# EAGLE design S8254A-HY2213-4S (EAGLE 7.6.0)

## Sheet 1 of 2
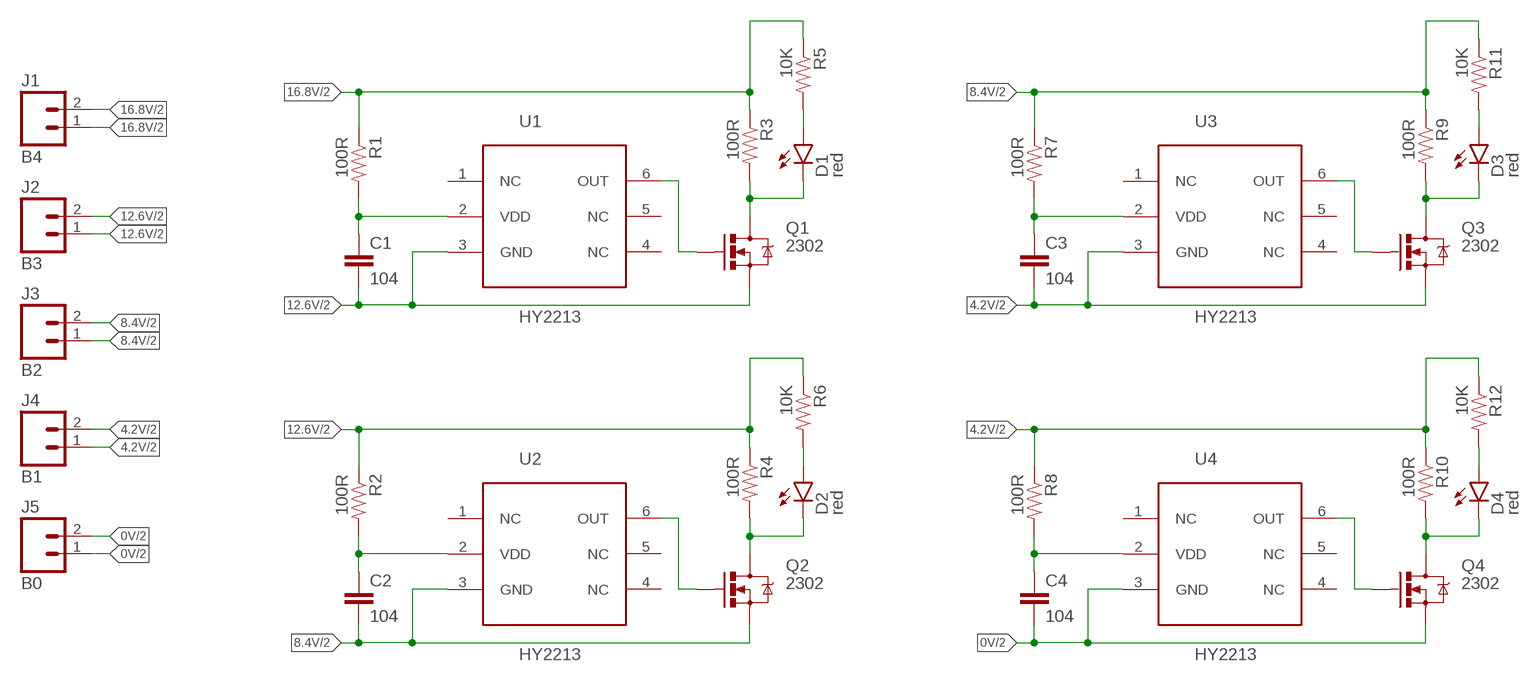
[diagram p0: schematic, sheet 1]

### Parts
C1  104  CAP0603-CAP  [0603-CAP]
C2  104  CAP0603-CAP  [0603-CAP]
C3  104  CAP0603-CAP  [0603-CAP]
C4  104  CAP0603-CAP  [0603-CAP]
D1  red  LED-SEEED-0603  [LED-0603-SEEED]
D2  red  LED-SEEED-0603  [LED-0603-SEEED]
D3  red  LED-SEEED-0603  [LED-0603-SEEED]
D4  red  LED-SEEED-0603  [LED-0603-SEEED]
J1  B4  M021X02_NO_SILK  [1X02_NO_SILK]
J2  B3  M021X02_NO_SILK  [1X02_NO_SILK]
J3  B2  M021X02_NO_SILK  [1X02_NO_SILK]
J4  B1  M021X02_NO_SILK  [1X02_NO_SILK]
J5  B0  M021X02_NO_SILK  [1X02_NO_SILK]
Q1  2302  MOSFET-NCHANNELAO3404A  [SOT23-3]
Q2  2302  MOSFET-NCHANNELAO3404A  [SOT23-3]
Q3  2302  MOSFET-NCHANNELAO3404A  [SOT23-3]
Q4  2302  MOSFET-NCHANNELAO3404A  [SOT23-3]
R1  100R  RESISTOR0603  [0603-RES]
R2  100R  RESISTOR0603  [0603-RES]
R3  100R  RESISTOR2512  [R2512]
R4  100R  RESISTOR2512  [R2512]
R5  10K  RESISTOR0603  [0603-RES]
R6  10K  RESISTOR0603  [0603-RES]
R7  100R  RESISTOR0603  [0603-RES]
R8  100R  RESISTOR0603  [0603-RES]
R9  100R  RESISTOR2512  [R2512]
R10  100R  RESISTOR2512  [R2512]
R11  10K  RESISTOR0603  [0603-RES]
R12  10K  RESISTOR0603  [0603-RES]
U1  HY2213  [SOT23-6]
U2  HY2213  [SOT23-6]
U3  HY2213  [SOT23-6]
U4  HY2213  [SOT23-6]

### Nets
0V: C4.2 J5.1 J5.2 Q4.2(S) U4.3(GND) ; also sheet 2
4.2V: C3.2 J4.1 J4.2 Q3.2(S) R8.1 R10.1 R12.1 U3.3(GND) ; also sheet 2
8.4V: C2.2 J3.1 J3.2 Q2.2(S) R7.1 R9.1 R11.1 U2.3(GND) ; also sheet 2
12.6V: C1.2 J2.1 J2.2 Q1.2(S) R2.1 R4.1 R6.1 U1.3(GND) ; also sheet 2
16.8V: J1.1 J1.2 R1.1 R3.1 R5.1 ; also sheet 2
N$1: C1.1 R1.2 U1.2(VDD)
N$3: Q1.1(G) U1.6(OUT)
N$4: D1.-(C) Q1.3(D) R3.2
N$6: C2.1 R2.2 U2.2(VDD)
N$7: Q2.1(G) U2.6(OUT)
N$8: D2.-(C) Q2.3(D) R4.2
N$9: C3.1 R7.2 U3.2(VDD)
N$10: Q3.1(G) U3.6(OUT)
N$11: D3.-(C) Q3.3(D) R9.2
N$12: C4.1 R8.2 U4.2(VDD)
N$13: Q4.1(G) U4.6(OUT)
N$14: D4.-(C) Q4.3(D) R10.2
N$25: D1.+(A) R5.2
N$27: D2.+(A) R6.2
N$29: D3.+(A) R11.2
N$31: D4.+(A) R12.2
Unconnected: U1.1(NC) U1.4(NC) U1.5(NC) U2.1(NC) U2.4(NC) U2.5(NC) U3.1(NC) U3.4(NC) U3.5(NC) U4.1(NC) U4.4(NC) U4.5(NC)

## Sheet 2 of 2
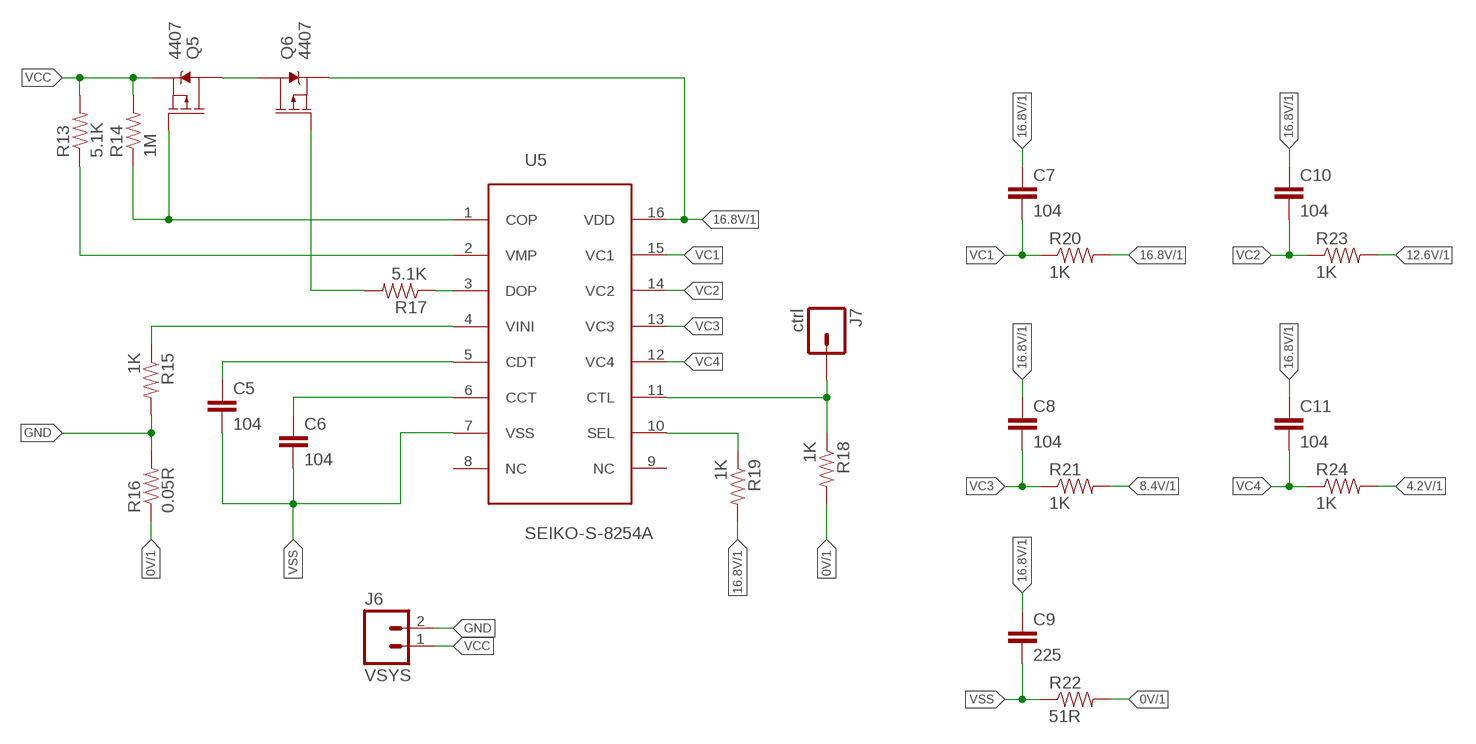
[diagram p1: schematic, sheet 2]

### Parts
C5  104  CAP0603-CAP  [0603-CAP]
C6  104  CAP0603-CAP  [0603-CAP]
C7  104  CAP0603-CAP  [0603-CAP]
C8  104  CAP0603-CAP  [0603-CAP]
C9  225  CAP0603-CAP  [0603-CAP]
C10  104  CAP0603-CAP  [0603-CAP]
C11  104  CAP0603-CAP  [0603-CAP]
J6  VSYS  M021X02_NO_SILK  [1X02_NO_SILK]
J7  ctrl  M01PTH  [1X01]
Q5  4407  MOSFET_PCH-NDS8434  [SO08]
Q6  4407  MOSFET_PCH-NDS8434  [SO08]
R13  5.1K  RESISTOR0603  [0603-RES]
R14  1M  RESISTOR0603  [0603-RES]
R15  1K  RESISTOR0603  [0603-RES]
R16  0.05R  RESISTOR2512  [R2512]
R17  5.1K  RESISTOR0603  [0603-RES]
R18  1K  RESISTOR0603  [0603-RES]
R19  1K  RESISTOR0603  [0603-RES]
R20  1K  RESISTOR0603  [0603-RES]
R21  1K  RESISTOR0603  [0603-RES]
R22  51R  RESISTOR0603  [0603-RES]
R23  1K  RESISTOR0603  [0603-RES]
R24  1K  RESISTOR0603  [0603-RES]
U5  SEIKO-S-8254A  [TSSOP16]

### Nets
0V: R16.1 R18.2 R22.2 ; also sheet 1
4.2V: R24.2 ; also sheet 1
8.4V: R21.2 ; also sheet 1
12.6V: R23.2 ; also sheet 1
16.8V: C7.1 C8.1 C9.1 C10.1 C11.1 Q6.1(S) Q6.2(S) Q6.3(S) R19.2 R20.2 U5.16(VDD) ; also sheet 1
GND: J6.2 R15.2 R16.2
N$2: R19.1 U5.10(SEL)
N$5: J7.1 R18.1 U5.11(CTL)
N$16: Q5.4(G) R14.1 U5.1(COP)
N$17: R17.1 U5.3(DOP)
N$18: Q6.4(G) R17.2
N$19: R13.1 U5.2(VMP)
N$20: R15.1 U5.4(VINI)
N$21: C5.1 U5.5(CDT)
N$22: C6.1 U5.6(CCT)
QQ: Q5.5(D) Q5.6(D) Q5.7(D) Q5.8(D) Q6.5(D) Q6.6(D) Q6.7(D) Q6.8(D)
VC1: C7.2 R20.1 U5.15(VC1)
VC2: C10.2 R23.1 U5.14(VC2)
VC3: C8.2 R21.1 U5.13(VC3)
VC4: C11.2 R24.1 U5.12(VC4)
VCC: J6.1 Q5.1(S) Q5.2(S) Q5.3(S) R13.2 R14.2
VSS: C5.2 C6.2 C9.2 R22.1 U5.7(VSS)
Unconnected: U5.8(NC) U5.9(NC)

## Library data of the parts
C1-C11 = z_jlc_smt:CAP: Capacitor Standard 0603 ceramic capacitor, and 0.1" leaded capacitor.
D1-D4 = z_jlc_smt:LED: LEDs Standard schematic elements and footprints for 5mm, 3mm, 1206, and 0603 sized LEDs. 5mm - Spark Fun Electronics SKU : COM-00529 (and others)
J1-J6 = SparkFun-Connectors:M02: Standard 2-pin 0.1" header. Use with - straight break away headers ( PRT-00116) - right angle break away headers (PRT-00553) - swiss pins (PRT-00743) - machine pins (PRT-00117) - female headers (PRT-00115) Molex polarized connector foot print use with: PRT-08233 with associated crimp pins and housings. 2.54_SCREWTERM for use with PRT-10571. 3.5mm Screw Terminal footprints for PRT-08084 5mm Screw Terminal footprints for use with PRT-08432
J7 = SparkFun-Connectors:M01: Header 1 Standard 1-pin 0.1" header. Use with straight break away headers (SKU : PRT-00116), right angle break away headers (PRT-00553), swiss pins (PRT-00743), machine pins (PRT-00117), and female headers (PRT-00115). SMTSO-256-ET is a "flush mount" nut for a 4-40 screw. The older package used to be too tight, and did not allow it to sit properly thru the drill hit. The latest (0.165DIA) fits nice and snug.
Q1-Q4 = xmgu2008:MOSFET-NCHANNEL: Common NMOSFET Parts MFG P/N Store ID Prod ID FDD8780 TRANS-09984 SI7820DN TRANS-11055 FDS6630A IC-08089 2N7002PW TRANS-11151 FQP30N06L COM-10213 TRANS-10060 BSS123LT1G TRANS-08345 BSS138 TRANS-00830 BS170 2N7000; PROD_ID: TRAN-12988
Q5 Q6 = SparkFun-DiscreteSemi:MOSFET_PCH: P-channel MOSFETs Voltage controlled devices that allow control of high current outputs. SparkFun Products: SparkFun ESP32 Thing <https://www.sparkfun.com/products/13907> SparkFun ESP8266 Thing <https://www.sparkfun.com/products/13231>; PROD_ID: TRANS-08355; VALUE: 6.5A/20V/35mΩ
R1-R24 = z_jlc_smt:RESISTOR: Resistor Basic schematic elements and footprints for 0603, 1206, and PTH resistors.
U1-U4 = xmgu2008:HY2213
U5 = xmgu2008:SEIKO-S-8254A

## Board
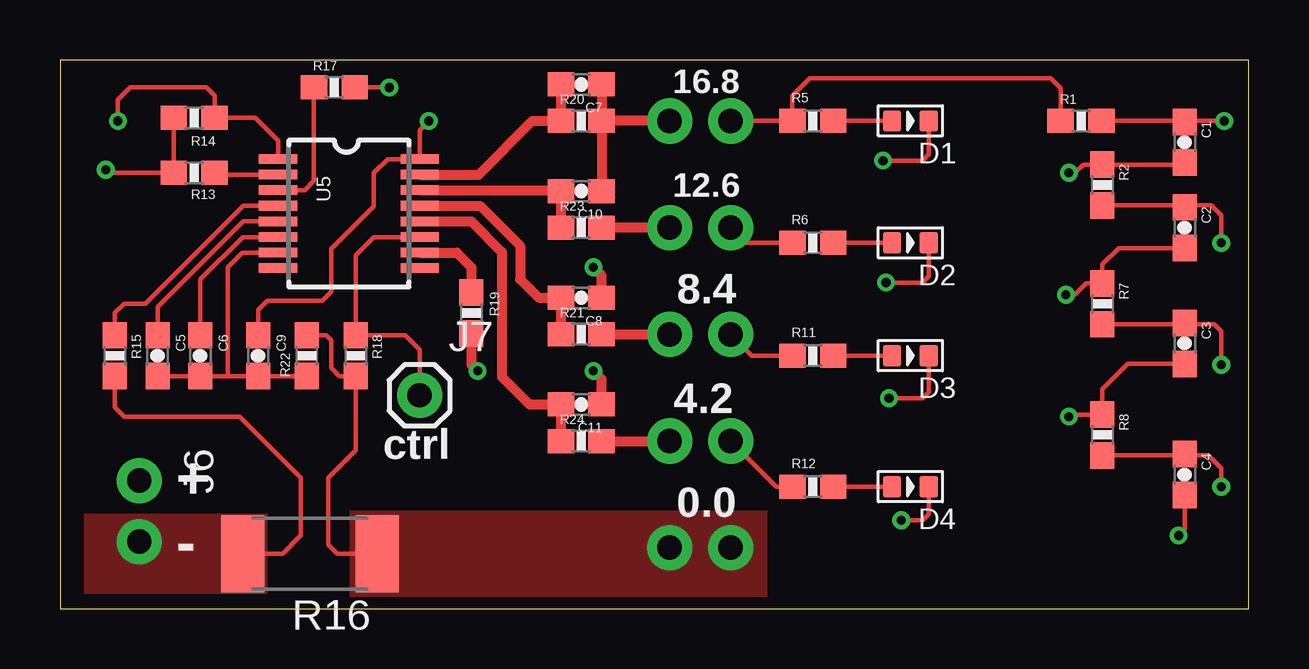
[diagram p2: board, top side]
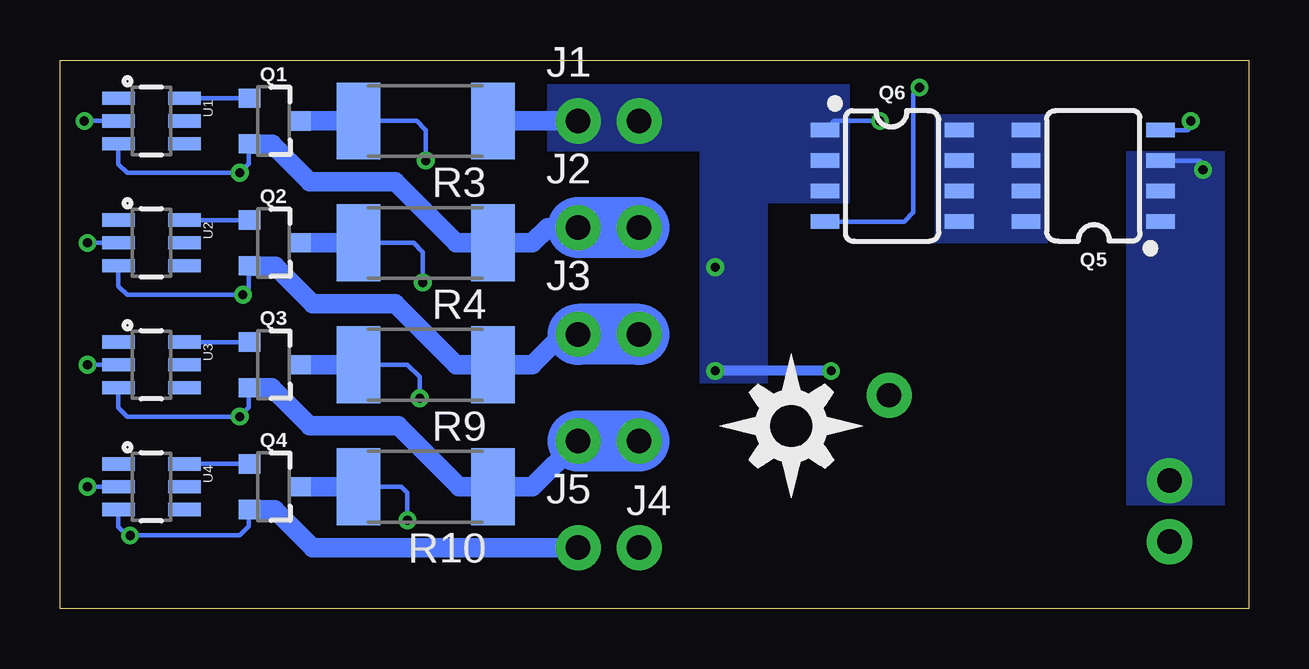
[diagram p3: board, bottom side, seen from below]

Size 49.53 x 22.86 mm. Coordinates in mm from the lower left corner, seen from the top.
Outline: 49.53,0 49.53,22.86 0,22.86 0,0 49.53,0
Copper layers (1*16): Top 0.035mm / dielectric 1.5mm / Bottom 0.035mm
Design rules "SparkFun-2-layer-TIGHT": minimum track width 7mil, minimum drill 15mil, track to track 7mil, track to pad 7mil, pad to pad 7mil, via to via 7mil, smd to smd 7mil, copper to edge 7mil, drill to drill 7mil, minimum pad ring 7mil, minimum via ring 7mil, stop-mask expansion 4mil, vias tented up to drill 20mil, thermal gap 10mil

### Footprints (pad centres in the part's own frame; a part is rotated, then mirrored left to right if it is on the bottom)
0603-CAP = smd 1.1 x 1: 1 -0.85,0; 2 0.85,0
LED-0603-SEEED = smd 0.762 x 0.889: + 0.762,0; - -0.762,0
1X02_NO_SILK = drill 1.016 pad 1.88: 1 0,0; 2 2.54,0
1X01 = drill 1.016 pad 1.88: 1 0,0
SOT23-3 = smd 0.8 x 0.9: 1 -0.95,-1; 2 0.95,-1; 3 0,1.1
SO08 = smd 0.6 x 1.2: 1 -1.905,-2.8; 2 -0.635,-2.8; 3 0.635,-2.8; 4 1.905,-2.8; 5 1.905,2.8; 6 0.635,2.8; 7 -0.635,2.8; 8 -1.905,2.8
0603-RES = smd 1.1 x 1: 1 -0.85,0; 2 0.85,0
R2512 = smd 1.8 x 3.2: 1 -2.8,0; 2 2.8,0
SOT23-6 = smd 0.55 x 1.35: 1 -0.95,-1.375; 2 0,-1.375; 3 0.95,-1.375; 4 0.95,1.375; 5 0,1.375; 6 -0.95,1.375
TSSOP16 = smd 0.4 x 1.6: 1 -2.225,-2.85; 2 -1.575,-2.85; 3 -0.925,-2.85; 4 -0.275,-2.85; 5 0.375,-2.85; 6 1.025,-2.85; 7 1.675,-2.85; 8 2.325,-2.85; 9 2.325,3.05; 10 1.675,3.05; 11 1.025,3.05; 12 0.375,3.05; 13 -0.275,3.05; 14 -0.925,3.05; 15 -1.575,3.05; 16 -2.225,3.05

### Placement (x,y rotation side)
C1  46.86,19.43 270 top
C2  46.86,15.88 270 top
C3  46.86,11.05 270 top
C4  46.86,5.59 270 top
C5  4.06,10.54 270 top
C6  5.84,10.54 270 top
C7  21.72,21.84 180 top
C8  21.72,12.95 180 top
C9  8.26,10.54 270 top
C10  21.72,17.4 180 top
C11  21.72,8.51 180 top
D1  35.43,20.32 180 top
D2  35.43,15.24 180 top
D3  35.43,10.54 180 top
D4  35.43,5.08 180 top
J1  27.94,20.32 0 bottom
J2  27.94,15.88 0 bottom
J3  27.94,11.43 0 bottom
J4  25.4,6.99 180 bottom
J5  27.94,2.54 0 bottom
J6  3.3,5.33 270 top
J7  14.99,8.89 0 top
Q1  40.64,20.32 270 bottom
Q2  40.64,15.24 270 bottom
Q3  40.64,10.16 270 bottom
Q4  40.64,5.08 270 bottom
Q5  6.48,18.03 90 bottom
Q6  14.86,18.03 270 bottom
R1  42.55,20.32 0 top
R2  43.43,17.65 270 top
R3  34.29,20.32 180 bottom
R4  34.29,15.24 180 bottom
R5  31.37,20.32 0 top
R6  31.37,15.24 0 top
R7  43.43,12.7 270 top
R8  43.43,7.24 270 top
R9  34.29,10.16 180 bottom
R10  34.29,5.08 180 bottom
R11  31.37,10.54 0 top
R12  31.37,5.08 0 top
R13  5.59,18.16 180 top
R14  5.59,20.45 180 top
R15  2.29,10.54 270 top
R16  10.41,2.29 180 top
R17  11.43,21.72 0 top
R18  12.32,10.54 270 top
R19  17.14,12.32 270 top
R20  21.72,20.32 0 top
R21  21.72,11.43 0 top
R22  10.29,10.54 90 top
R23  21.72,15.88 0 top
R24  21.72,6.99 0 top
U1  45.72,20.32 270 bottom
U2  45.72,15.24 270 bottom
U3  45.72,10.16 270 bottom
U4  45.72,5.08 270 bottom
U5  11.94,16.51 270 top
U$1  [DIYNOVA_LOGO]  22.1,4.57 0 bottom

### Tracks (layer width: path | path; a pad name or v marks a point on that pad's centre or on a via)
0V  (via drill 0.38)
  Top 0.178: R22.2 11.09,11.39 11.3,11.18 11.3,10.03 11.64,9.69 R18.2 12.32,6.6 11.18,5.46 11.18,2.67 11.56,2.29 R16.1 | C4.2 46.86,3.3 v46.61,3.05
  Bottom 0.178: U4.3 47.09,3.41 46.74,3.05 v46.61,3.05 42.04,3.05 41.66,3.43 41.66,4.11 Q4.2
  Bottom 0.813: Q4.2 40.58,4.13 38.99,2.54 J5.1
  pour Top (isolate 0.305, no thermals): 12.06,4.06 12.06,0.51 29.46,0.51 29.46,4.06
4.2V  (via drill 0.38)
  Top 0.178: R12.1 29.84,5.08 J4.2 | C3.2 44.49,10.2 43.43,9.14 R8.1 42.12,8.09 v42.04,8
  Top 0.406: R24.2 J4.1
  Bottom 0.178: U3.3 47.09,8.36 46.74,8 v42.04,8 41.66,8.38 41.66,9.19 Q3.2
  Bottom 0.813: Q3.2 40.71,9.21 39.12,7.62 35.43,7.62 32.89,5.08 R10.1 29.84,5.08 J4.2
  Bottom 2.54: J4.1 J4.2
8.4V  (via drill 0.38)
  Top 0.178: R11.1 28.83,10.54 J3.1 | v41.91,13.08 42.29,13.08 42.76,13.55 R7.1 43.43,14.35 44.11,15.03 C2.2
  Top 0.406: R21.2 J3.2
  Bottom 0.178: U2.3 47.09,13.44 46.74,13.08 v41.91,13.08 41.66,13.34 41.66,14.27 Q2.2
  Bottom 0.813: 41.66,14.27 40.56,14.27 38.99,12.7 35.56,12.7 33.02,10.16 R9.1 29.84,10.16 28.57,11.43 J3.1
  Bottom 2.54: J3.2 J3.1
12.6V  (via drill 0.38)
  Top 0.178: R6.1 28.57,15.24 J2.1 | v42.04,18.16 42.29,18.16 42.63,18.5 R2.1 46.78,18.5 C1.2
  Top 0.406: J2.2 R23.2
  Bottom 0.178: U1.3 47.09,18.52 46.74,18.16 v42.04,18.16 41.66,18.54 41.66,19.35 Q1.2
  Bottom 0.813: 41.66,19.35 40.69,19.35 39.12,17.78 35.56,17.78 33.02,15.24 R4.1 29.84,15.24 29.21,15.88 J2.1
  Bottom 2.54: J2.2 J2.1
16.8V  (via drill 0.38)
  Top 0.178: C9.1 8.26,12.45 8.64,12.83 10.92,12.83 11.3,13.21 11.3,14.99 13.08,16.76 13.08,18.16 13.65,18.73 U5.16 14.99,19.94 v15.37,20.32 | J1.1 R5.1 30.52,21.38 31.24,22.1 41.27,22.1 41.7,21.68 R1.1
  Top 0.406: J1.2 R20.2 | C7.1 R20.2 | R19.2 17.14,10.16 v17.4,9.91 | R20.2 C10.1 | C11.1 22.57,9.56 v22.23,9.91 | C8.1 22.57,13.88 v22.23,14.22
  Bottom 0.178: v15.37,20.32 17.28,20.32 Q6.1
  Bottom 0.406: v17.4,9.91 v22.23,9.91
  Bottom 0.813: J1.1 R3.1
  pour Bottom (isolate 0.305, no thermals): 29.21,21.84 16.64,21.84 16.64,16.89 20.07,16.89 20.07,9.4 22.86,9.4 22.86,19.05 29.21,19.05
GND
  Top 0.178: R15.2 2.29,8.38 2.67,8 7.49,8 10.03,5.46 10.03,3.05 9.27,2.29 R16.2
  pour Top (isolate 0.305, no thermals): 8.64,3.94 1.02,3.94 1.02,0.64 8.64,0.64
N$1  (via drill 0.38)
  Top 0.178: R1.2 U1.2 | U1.2 v48.51,20.32 | C1.1 47.06,20.28 U1.2
  Bottom 0.178: U1.2 v48.51,20.32
N$2
  Top 0.406: U5.10 16.53,14.84 17.14,14.22 R19.1
N$3
  Bottom 0.178: U1.6 Q1.1
N$4  (via drill 0.38)
  Top 0.178: v34.29,18.67 35.94,18.67 36.2,18.92 D1.-
  Bottom 0.178: v34.29,18.67 34.29,19.94 34.67,20.32 R3.2
  Bottom 0.813: Q1.3 R3.2
N$5
  Top 0.178: U5.11 13.07,15.48 12.32,14.73 R18.1 14.39,11.39 14.99,10.79 J7.1
N$6  (via drill 0.38)
  Top 0.178: v48.39,15.24 48.39,16.38 47.97,16.8 46.86,16.8 | R2.2 46.86,16.8 | C2.1 46.86,16.8
  Bottom 0.178: U2.2 v48.39,15.24
N$7
  Bottom 0.178: U2.6 Q2.1
N$8  (via drill 0.38)
  Top 0.178: v34.42,13.59 35.94,13.59 36.2,13.84 D2.-
  Bottom 0.178: v34.42,13.59 34.42,14.86 34.8,15.24 R4.2
  Bottom 0.813: Q2.3 R4.2
N$9  (via drill 0.38)
  Top 0.178: R7.2 46.86,11.85 | 46.86,11.85 48.09,11.85 48.39,11.56 v48.39,10.16 | C3.1 46.86,11.85
  Bottom 0.178: U3.2 v48.39,10.16
N$10
  Bottom 0.178: U3.6 Q3.1
N$11  (via drill 0.38)
  Top 0.178: v34.54,8.76 35.94,8.76 36.2,9.02 D3.-
  Bottom 0.178: v34.54,8.76 34.54,9.65 35.05,10.16 R9.2
  Bottom 0.813: Q3.3 R9.2
N$12  (via drill 0.38)
  Top 0.178: R8.2 46.86,6.39 | 46.86,6.39 47.84,6.39 48.39,5.84 v48.39,5.08 | C4.1 46.86,6.39
  Bottom 0.178: U4.2 v48.39,5.08
N$13
  Bottom 0.178: U4.6 Q4.1
N$14  (via drill 0.38)
  Top 0.178: v35.05,3.68 35.94,3.68 36.2,3.94 D4.-
  Bottom 0.178: v35.05,3.68 35.05,4.83 35.31,5.08 R10.2
  Bottom 0.813: Q4.3 R10.2
N$16  (via drill 0.38)
  Top 0.178: U5.1 9.09,19.49 8.13,20.45 R14.1 6.44,21.38 6.1,21.72 2.92,21.72 2.41,21.21 v2.41,20.32
  Bottom 0.178: v2.41,20.32 2.41,20.07 2.54,19.94 Q5.4
N$17
  Top 0.178: U5.3 10.2,17.43 10.58,17.82 R17.1
N$18  (via drill 0.38)
  Top 0.178: v13.72,21.72 R17.2
  Bottom 0.178: Q6.4 14.35,16.13 13.97,16.51 13.97,21.46 v13.72,21.72
N$19
  Top 0.178: U5.2 6.51,18.09 R13.1
N$20
  Top 0.178: U5.4 7.64,16.79 3.56,12.7 2.67,12.7 2.29,12.32 R15.1
N$21
  Top 0.178: U5.5 7.63,16.14 4.06,12.57 C5.1
N$22
  Top 0.178: U5.6 7.61,15.48 5.84,13.72 C6.1
N$25
  Top 0.178: R5.2 D1.+
N$27
  Top 0.178: D2.+ R6.2
N$29
  Top 0.178: D3.+ R11.2
N$31
  Top 0.178: D4.+ R12.2
QQ
  pour Bottom (isolate 0.305, no thermals): 8.51,20.57 13.08,20.57 13.08,15.24 8.38,15.24 8.38,20.57
VC1
  Top 0.406: U5.15 17.45,18.09 19.68,20.32 R20.1 C7.2
VC2
  Top 0.406: U5.14 20.83,17.43 C10.2 R23.1
VC3
  Top 0.406: U5.13 17.5,16.79 19.18,15.11 19.18,13.72 19.94,12.95 C8.2 R21.1
VC4
  Top 0.406: U5.12 17.14,16.14 18.41,14.86 18.41,9.65 19.56,8.51 C11.2 R24.1
VCC  (via drill 0.38)
  Top 0.178: R14.2 R13.2 2.03,18.16 v1.91,18.29
  Bottom 0.178: v1.91,18.29 1.91,18.54 2.03,18.67 Q5.3
  pour Bottom (isolate 0.305, no thermals): 4.83,19.05 1.02,19.05 1.02,4.32 5.08,4.32 5.08,19.05
VSS
  Top 0.178: C5.2 C6.2 6.99,9.69 | U5.7 7.6,14.84 6.99,14.22 6.99,9.69 | 6.99,9.69 C9.2 R22.1

### Text on the board
tPlace: 16.8 | 12.6 | 8.4 | 4.2 | ctrl | + | 0.0 | -